# EAGLE design emru_nano (EAGLE 7.6.0)
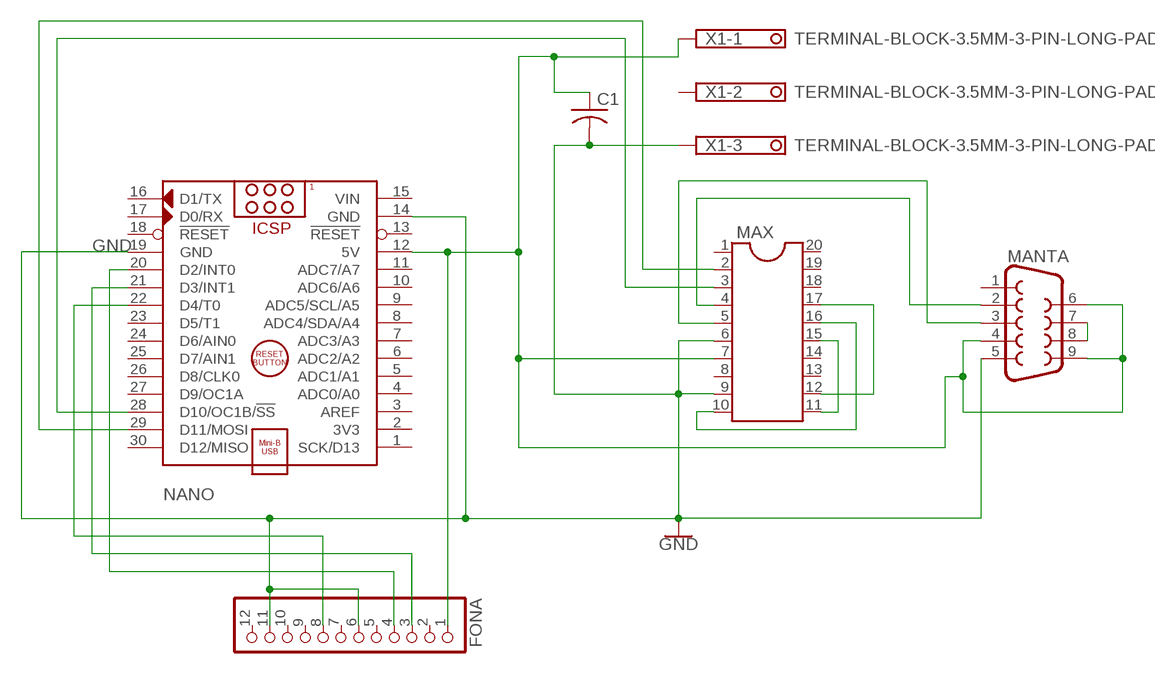
[diagram p0: schematic, sheet 1]

## Parts
C1  C-US025-025X050  [C025-025X050]
FONA  PINHD-1X12  [1X12]
MANTA  DB9MALE  [DB9_MALE]
MAX  DIL20  [DIL20]
NANO  ARDUINO_NANO  [ARDUINO_NANO]
X1  TERMINAL-BLOCK-3.5MM-3-PIN-LONG-PAD  [TERMINAL-BLOCK-3-PIN-3.5MM-LONG-PAD]

## Nets
GND: C1.2 FONA.6 FONA.11 MANTA.5 MAX.6 MAX.9 NANO.14(GND) NANO.19(GND) X1.3
N$2: MANTA.7 MANTA.8
N$3: FONA.4 NANO.20(D2/INT0)
N$4: C1.1 FONA.1 MANTA.4 MANTA.6 MANTA.9 MAX.7 NANO.12(5V) X1.1
N$5: MAX.10 MAX.16
N$6: MAX.11 MAX.15
N$7: MAX.12 MAX.17
N$8: MANTA.2 MAX.4
N$9: MANTA.3 MAX.5
N$12: MAX.2 NANO.29(D11/MOSI)
N$13: MAX.3 NANO.28(D10/OC1B/!SS)
N$14: FONA.3 NANO.21(D3/INT1)
N$15: FONA.8 NANO.22(D4/T0)
Unconnected: FONA.2 FONA.5 FONA.7 FONA.9 FONA.10 FONA.12 MANTA.1 MAX.1 MAX.8 MAX.13 MAX.14 MAX.18 MAX.19 MAX.20 NANO.1(SCK/D13) NANO.2(3V3) NANO.3(AREF) NANO.4(ADC0/A0) NANO.5(ADC1/A1) NANO.6(ADC2/A2) NANO.7(ADC3/A3) NANO.8(ADC4/SDA/A4) NANO.9(ADC5/SCL/A5) NANO.10(ADC6/A6) NANO.11(ADC7/A7) NANO.13(!RESET) NANO.16(D1/TX) NANO.17(D0/RX) NANO.18(!RESET) NANO.23(D5/T1) NANO.24(D6/AIN0) NANO.25(D7/AIN1) NANO.26(D8/CLK0) NANO.27(D9/OC1A) NANO.30(D12/MISO) X1.2

## Power pins joined to a net without a drawn wire
VIN: NANO.15(VIN)

## Library data of the parts
C1 = adafruit:C-US: CAPACITOR, American symbol
FONA = pinhead:PINHD-1X12: PIN HEADER
MANTA = SparkFun-Connectors:DB9: DB9 Connector Standard DB9 (D-Sub 9) serial connector. Can be used for CAN bus as well as RS485 and RS232. Footprint production proven. Here is the female version connector we sell at SparkFun: 9 Pin Female Serial Connector - PCB Mount <https://www.sparkfun.com/products/429> (PRT-00429) This connector has been used on the following SparkFun products: SparkFun RS232 Shifter - SMD <https://www.sparkfun.com/products/449> (PRT-00449) SparkFun RS232 Shifter SMD (No DB9) <https://www.sparkfun.com/products/8780> (PRT-08780); PROD_ID: CONN-09904
MAX = ic-package:DIL20: Dual In Line / Socket
NANO = ArduinoNanoV30:ARDUINO_NANO: Arduino Nano V3.0 Module Overview: The Arduino Nano is a small, complete, and breadboard-friendly board based on the ATmega328 (Arduino Nano 3.x) or ATmega168 (Arduino Nano 2.x). It has more or less the same functionality of the Arduino Duemilanove, but in a different package. It lacks only a DC power jack, and works with a Mini-B USB cable instead of a standard one. The Nano was designed and is being produced by Gravitech <http://www.gravitech.us/arna30wiatp.html>. General specifications: Item Value Microcontroller Atmel ATmega168 or ATmega328 Operating Voltage (logic level) 5 V Input Voltage (recommended) 7-12 V Input Voltage (limits) 6-20 V Digital I/O Pins 14 (of which 6 provide PWM output) Analog Input Pins 8 DC Current per I/O Pin 40 mA Flash Memory 16 KB (ATmega168) or 32 KB (ATmega328) of which 2 KB used by bootloader SRAM 1 KB (ATmega168) or 2 KB (ATmega328) EEPROM 512 bytes (ATmega168) or 1 KB (ATmega328) Clock Speed 16 MHz Dimensions (Inches) 0.73" x 1.70" Dimensions (mm) 18mm x 45mm Overall height About 9 mm (not including pins) Weigth 5 g Power: The Arduino Nano can be powered via the Mini-B USB connection, 6-20V unregulated external power supply (pin 30), or 5V regulated external power supply (pin 27). The power source is automatically selected to the highest voltage source. Memory: The ATmega168 has 16 KB of flash memory for storing code (of which 2 KB is used for the bootloader); the ATmega328 has 32 KB, (also with 2 KB used for the bootloader). The ATmega168 has 1 KB of SRAM and 512 bytes of EEPROM (which can be read and written with the EEPROM library); the ATmega328 has 2 KB of SRAM and 1 KB of EEPROM. Input and Output: Each of the 14 digital pins on the Nano can be used as an input or output, using pinMode(), digitalWrite(), and digitalRead() functions. They operate at 5 volts. Each pin can provide or receive a maximum of 40 mA and has an internal pull-up resistor (disconnected by default) of 20-50 kOhms. In addition, some pins have specialized functions. Visit Arduino - ArduinoBoardNano <https://www.arduino.cc/en/Main/ArduinoBoardNano>
X1 = Rembrandt Electronics - Terminal Block 3-5mm v1-0:TERMINAL-BLOCK-3.5MM-3-PIN: Terminal Block 3.5mm Pitch: 3,5 mm Number of pins: 3 Created by Rembrandt Electronics www.rembrandtelectronics.com

## Board
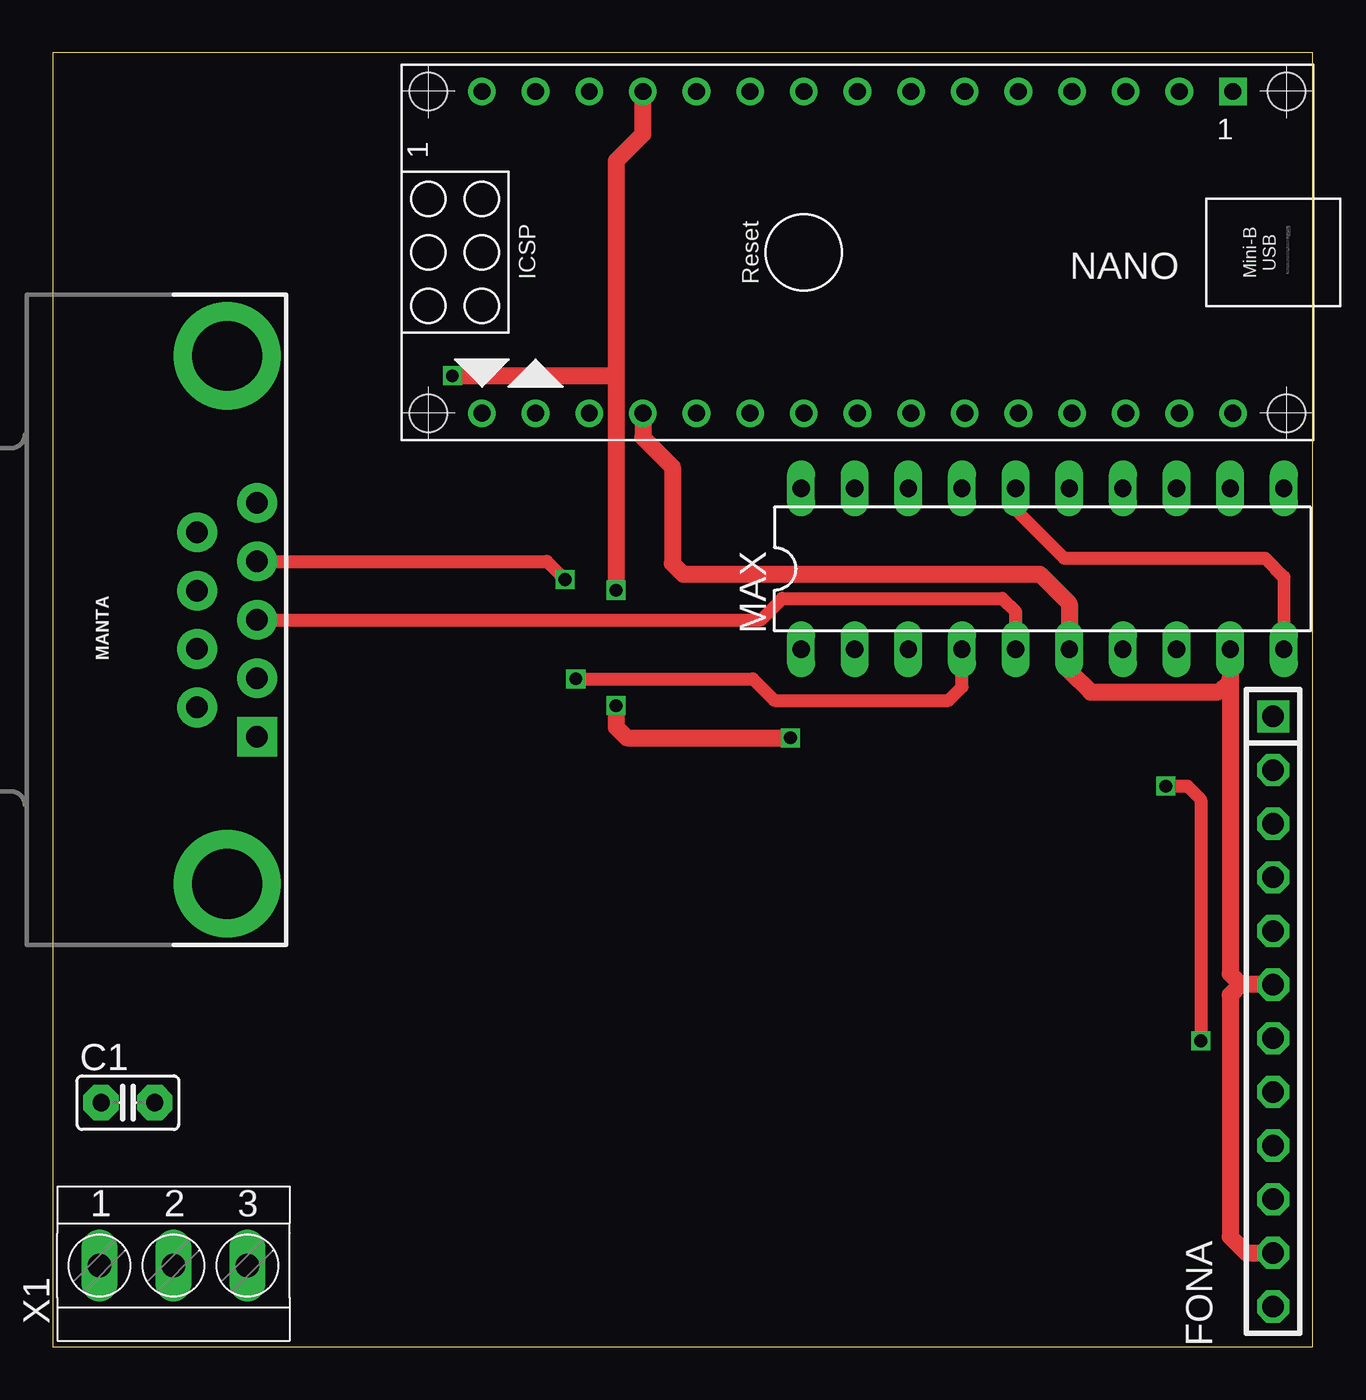
[diagram p1: board, top side]
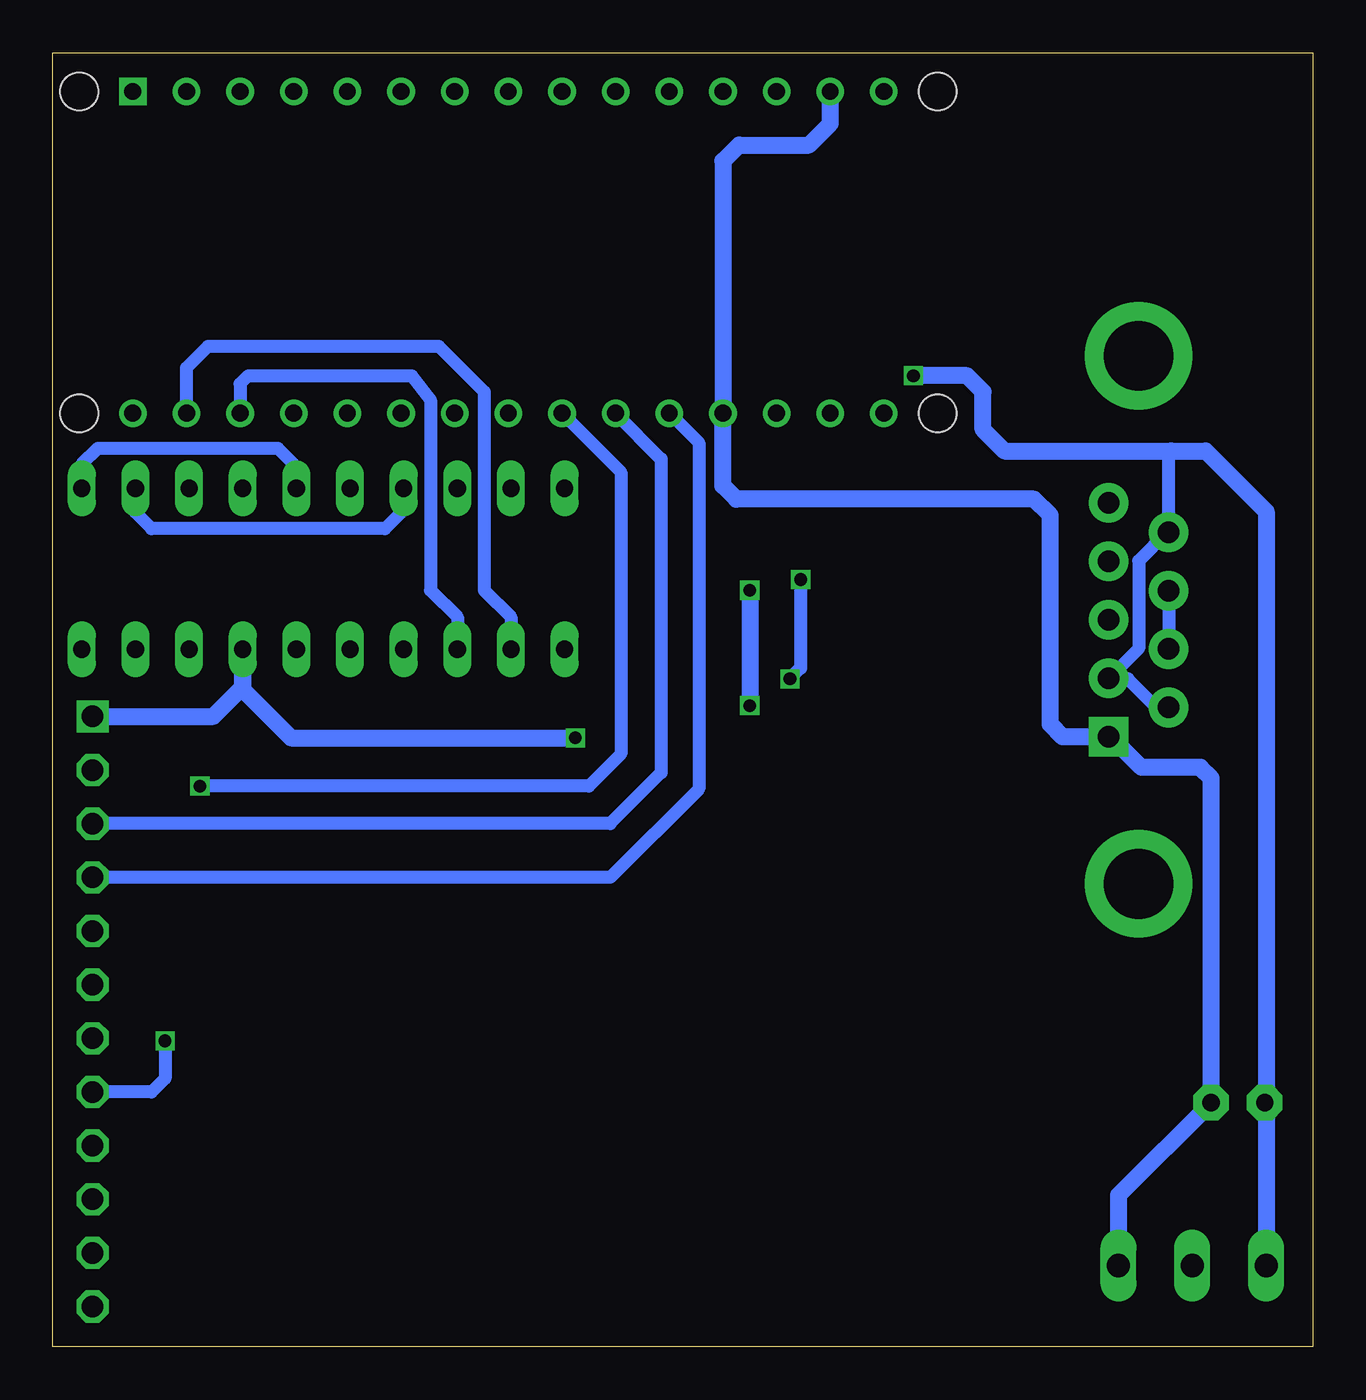
[diagram p2: board, bottom side, seen from below]

Size 59.67 x 61.27 mm. Coordinates in mm from the lower left corner, seen from the top.
Outline: 0,0 59.67,0 59.67,61.27 0,61.27 0,0
Copper layers (1*16): Top 0.035mm / dielectric 1.5mm / Bottom 0.035mm
Design rules "SeeedStudio_2layer_DRU_no_angle_20140221": minimum track width 6mil, minimum drill 12mil, track to track 6mil, track to pad 6mil, pad to pad 6mil, via to via 6mil, smd to smd 0mil, copper to edge 10mil, drill to drill 10mil, minimum pad ring 10mil, minimum via ring 6mil, stop-mask expansion 2mil, vias tented up to drill 100mil, thermal gap 10mil

### Footprints (pad centres in the part's own frame; a part is rotated, then mirrored left to right if it is on the bottom)
C025-025X050 = drill 0.813 pad 1.676 octagon: 1 -1.27,0; 2 1.27,0
1X12 = drill 1.016 square: 1 -13.97,0 | drill 1.016 octagon: 2 -11.43,0; 3 -8.89,0; 4 -6.35,0; 5 -3.81,0; 6 -1.27,0; 7 1.27,0; 8 3.81,0; 9 6.35,0; 10 8.89,0; 11 11.43,0; 12 13.97,0
DB9_MALE = drill 1.016 pad 1.88: 1 5.54,-1.42; 2 2.77,-1.42; 3 0,-1.42; 4 -2.77,-1.42; 6 4.15,1.42; 7 1.38,1.42; 8 -1.38,1.42; 9 -4.15,1.42 | drill 1.016 pad 1.88 square: 5 -5.54,-1.42 | drill 3.302 pad 5.08: G1 -12.5,0; G2 12.5,0
DIL20 = drill 0.813 long: 1 -11.43,-3.81; 2 -8.89,-3.81; 3 -6.35,-3.81; 4 -3.81,-3.81; 5 -1.27,-3.81; 6 1.27,-3.81; 7 3.81,-3.81; 8 6.35,-3.81; 9 8.89,-3.81; 10 11.43,-3.81; 11 11.43,3.81; 12 8.89,3.81; 13 6.35,3.81; 14 3.81,3.81; 15 1.27,3.81; 16 -1.27,3.81; 17 -3.81,3.81; 18 -6.35,3.81; 19 -8.89,3.81; 20 -11.43,3.81
ARDUINO_NANO = drill 0.8 square: 1 -20.32,-7.62 | drill 0.8: 2 -17.78,-7.62; 3 -15.24,-7.62; 4 -12.7,-7.62; 5 -10.16,-7.62; 6 -7.62,-7.62; 7 -5.08,-7.62; 8 -2.54,-7.62; 9 0,-7.62; 10 2.54,-7.62; 11 5.08,-7.62; 12 7.62,-7.62; 13 10.16,-7.62; 14 12.7,-7.62; 15 15.24,-7.62; 16 15.24,7.62; 17 12.7,7.62; 18 10.16,7.62; 19 7.62,7.62; 20 5.08,7.62; 21 2.54,7.62; 22 0,7.62; 23 -2.54,7.62; 24 -5.08,7.62; 25 -7.62,7.62; 26 -10.16,7.62; 27 -12.7,7.62; 28 -15.24,7.62; 29 -17.78,7.62; 30 -20.32,7.62 | hole 1.778: -22.86,-7.62; -22.86,7.62; 17.78,7.62; 17.78,-7.62
TERMINAL-BLOCK-3-PIN-3.5MM-LONG-PAD = drill 1.1 pad 1.7 long: 1 -3.5,-0.1; 2 0,-0.1; 3 3.5,-0.1

### Placement (x,y rotation side)
C1  3.56,11.56 0 top
FONA  57.78,15.88 270 top
MANTA  8.26,34.42 90 top
MAX  46.86,36.83 0 top
NANO  35.56,51.82 180 top
X1  5.71,3.94 0 top

### Tracks (layer width: path | path; a pad name or v marks a point on that pad's centre or on a via)
GND
  Top 0.61: 55.12,30.99 55.75,31.62
  Top 0.813: MAX.9 55.75,31.62 55.75,17.65 56.26,17.14 | FONA.6 56.26,17.14 | 56.26,17.14 55.75,16.64 55.75,5.21 56.52,4.45 FONA.11 | 55.12,30.99 49.15,30.99 48.13,32 MAX.6 48.13,35.18 46.74,36.58 29.84,36.58 29.34,37.08 29.34,41.66 27.94,43.05 NANO.19
  Bottom 0.813: NANO.14 22.86,57.91 23.88,56.9 27.18,56.9 27.94,56.13 NANO.19 27.94,40.77 27.3,40.13 13.21,40.13 12.45,39.37 12.45,29.46 11.86,28.88 MANTA.5 9.57,28.88 8.13,27.43 5.33,27.43 4.83,26.92 C1.2 9.21,7.17 X1.3 9.27,3.89
N$2
  Bottom 0.61: MANTA.7 MANTA.8
N$3
  Bottom 0.61: NANO.20 29.08,42.8 29.08,26.42 33.27,22.23 FONA.4
N$4  (via drill 0.6)
  Top 0.813: 26.67,45.97 26.67,56.13 27.94,57.4 NANO.12 | 26.67,45.97 v26.67,35.81 | v26.67,30.35 26.67,29.34 27.18,28.83 v34.92,28.83 | v18.92,45.97 26.67,45.97
  Bottom 0.61: MANTA.9 7.41,30.27 8.76,31.62 9.65,31.62 MANTA.4 8.26,33.07 8.26,37.21 6.9,38.57 MANTA.6 6.83,42.31 6.73,42.42
  Bottom 0.813: 2.21,11.49 2.21,39.55 5.08,42.42 6.73,42.42 14.61,42.42 15.62,43.43 15.62,45.21 16.38,45.97 v18.92,45.97 | 2.21,11.49 X1.1 | C1.1 2.21,11.49 | FONA.1 52.07,29.84 50.67,31.24 MAX.7 50.67,31.11 48.39,28.83 v34.92,28.83 | v26.67,35.81 v26.67,30.35
N$5
  Top 0.61: MAX.16 45.59,39.62 47.88,37.34 57.4,37.34 58.29,36.45 MAX.10
N$6
  Bottom 0.61: MAX.11 58.29,41.78 57.53,42.55 49.02,42.55 48.13,41.66 MAX.15
N$7
  Bottom 0.61: MAX.17 43.05,39.62 43.94,38.73 54.99,38.73 55.75,39.5 MAX.12
N$8  (via drill 0.6)
  Top 0.61: MANTA.2 23.39,37.19 v24.26,36.32 | v24.77,31.62 33.15,31.62 34.16,30.61 42.42,30.61 43.05,31.24 MAX.4
  Bottom 0.61: v24.26,36.32 24.26,32.13 v24.77,31.62
N$9
  Top 0.61: MAX.5 45.59,34.8 44.96,35.43 34.54,35.43 33.53,34.42 MANTA.3
N$12
  Bottom 0.61: MAX.2 37.97,34.54 39.24,35.81 39.24,45.21 41.4,47.37 52.32,47.37 53.34,46.35 NANO.29
N$13
  Bottom 0.61: NANO.28 50.8,45.59 50.42,45.97 42.67,45.97 41.78,44.83 41.78,35.81 40.51,34.54 MAX.3
N$14
  Bottom 0.61: NANO.21 30.86,42.04 30.86,27.18 33.27,24.77 FONA.3
N$15  (via drill 0.6)
  Top 0.61: v52.7,26.54 53.72,26.54 54.36,25.91 v54.36,14.48
  Bottom 0.61: NANO.22 32.77,41.4 32.77,28.07 34.29,26.54 v52.7,26.54 | v54.36,14.48 54.36,12.7 54.99,12.06 FONA.8